# EasyEDA Pro project GEEKS_DEVELOPMENT_BOARD_STM32F4.eprj, board PCB1
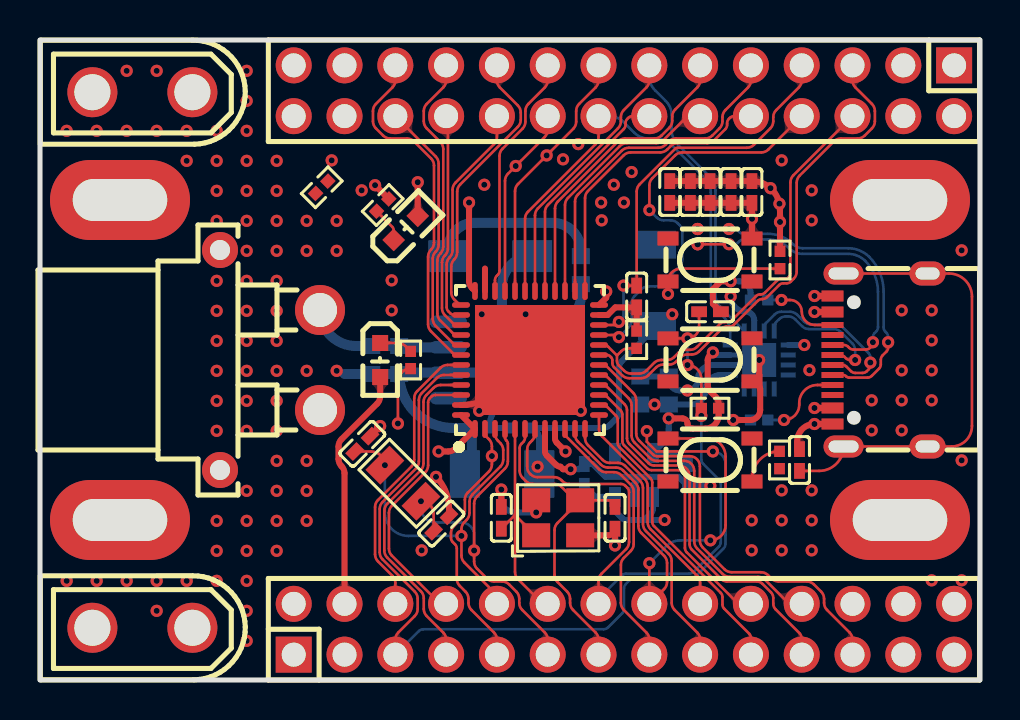
[diagram p2: board, top side]
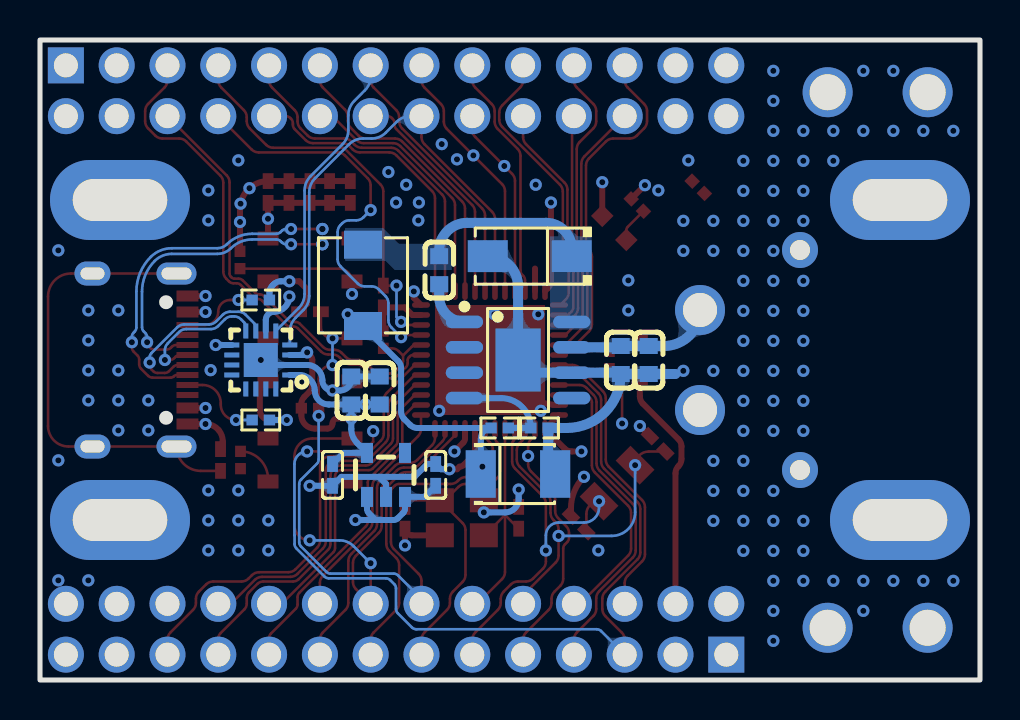
[diagram p3: board, bottom side, seen from below]

Outline 47 x 32 mm; copper layers: Top Layer, Inner1, Inner2, Bottom Layer. Coordinates in mm from the lower left corner of the outline.
Outline path: rectangle 0,32 47,0
Stack: Top Layer 0.035mm 外层铜厚1oz / Dielectric1 0.2104mm 7628 RC49% 8.6mil / Inner1 0.0152mm 内层铜厚 / Dielectric2 1.065mm 1.1mm H/HOZ 含铜 / Inner2 0.0152mm 内层铜厚 / Dielectric3 0.2104mm 7628 RC49% 8.6mil / Bottom Layer 0.035mm 外层铜厚1oz

## Design rules (mm)
net FS_D-: DP1
net FS_D+: DP1
template: 自定义配置
spacing copperThickness1oz (default): track to track 0.102, other pairs 0.152 to 0.3
spacing copperThickness2oz: track to track 0.203, other pairs 0.152 to 0.3
track width copperThickness1oz (default): min 0.13, default 0.13, max 0.5
track width copperThickness2oz: min 0.203, default 0.254, max 2.54
track width power: min 0.3, default 0.3, max 0.3
track width 12v: min 0.5, default 0.5, max 0.5
differential pair differentialPair (default): width min 0.127, default 0.254, max 2.54; gap min 0.152, default 0.152
via viaSize (default): diameter min 0.5, default 0.61, max 10; hole min 0.3, default 0.305, max 6.3
net 3V3 uses power
net GND uses power
net 5V uses power
net 12V uses 12v, copperRegion1
net AGND uses 12v, copperRegion1

## Placement (name value [footprint] x y rotation side)
C1  100nF  [C0402]  35.59 24.4 270 top
C2  100nF  [C0402]  34.55 24.4 270 top
C3  100nF  [C0402]  33.5 24.4 270 top
C4  100nF  [C0402]  32.52 24.4 270 top
C5  4.7uF  [C0402]  31.49 24.4 270 top
C34  100nF  [C0402]  33.5 18.41 180 top
C56  10uF  [C0402]  27.22 10.25 270 bottom
C57  10uF  [C0402]  32.37 10.25 90 bottom
C58  12pF  [C0402]  16.12 11.81 225 top
C59  12pF  [C0402]  20.07 7.82 225 top
C60  10pF  [C0402]  23.07 8.11 90 top
C61  10pF  [C0402]  28.75 8.11 90 top
C65  100nF  [C0402]  37.97 11 270 top
C67  100nF  [C0603]  31.44 14.48 270 bottom
C68  100nF  [C0603]  30.02 14.48 90 bottom
C70  10uF  [C0603]  17.96 16 90 bottom
C78  100nF  [C0603]  27.04 20.49 270 bottom
C79  220uF  [CASE-B_3528]  23.1 10.3 180 bottom
C80  10uF  [C0603]  16.57 16 90 bottom
C81  4.7uF  [C0402]  29.83 19.17 270 top
CN1  XT30UPB-M  [CONN-TH_XT30UPB-M]  5.12 29.39 180 top
CN2  XT30UPB-M  [CONN-TH_XT30UPB-M]  5.12 2.61 180 top
D1  SS34  [SMA_L4.3-W2.5-LS5.0-RD]  22.51 21.19 0 bottom
L5  15uH  [IND-SMD_L4.6-W4.2_SMMS0420]  30.85 19.73 90 bottom
LED3  19-217/BHC-BL2M2TY/3T  [LED0603-R-RD_BLUE]  18.29 22.6 45 top
LED4  19-217/BHC-BL2M2TY/3T  [LED0603-R-RD_BLUE]  17.01 16 270 top
NOREF  -  [Pad_e89]  43 8 0 top
NOREF#2  -  [Pad_e87]  4 8 0 top
NOREF#3  -  [Pad_e88]  43 24 0 top
NOREF#4  -  [Pad_e85]  4 24 0 top
R18  10kΩ  [R0402]  37 21 90 top
R20  10kΩ  [R0402]  33.5 13.59 0 top
R70  680Ω  [R0402]  17.13 23.75 45 top
R76  10kΩ  [R0402]  29.83 17.02 90 top
R77  5.1kΩ  [R0402]  35.96 13 180 bottom
R78  5.1kΩ  [R0402]  35.96 19 180 bottom
R79  100Ω  [R0402]  36.98 11 90 top
R82  10kΩ  [R0402]  24.01 12.6 0 bottom
R83  3.24kΩ  [R0402]  22.03 12.6 0 bottom
R84  680Ω  [R0402]  18.53 16 270 top
R85  0Ω  [R0402]  14.09 24.64 225 top
SW1  SKRPACE010  [KEY-SMD_4P-L4.2-W3.2-P2.20-LS4.6]  33.5 16.01 180 top
SW2  SKRPACE010  [KEY-SMD_4P-L4.2-W3.2-P2.20-LS4.6]  33.5 21 180 top
SW3  SKRPACE010  [KEY-SMD_4P-L4.2-W3.2-P2.20-LS4.6]  33.5 11 180 top
U1  STM32F401CCU6  [UFQFPN-48_L7.0-W7.0-P0.50-BL-EP]  24.5 16 0 top
U8  TPS5430DDA  [ESOP-8_L4.9-W3.9-P1.27-LS6.0-BL-EP-2]  23.09 16 270 bottom
U14  HT7833  [SOT-23-5_L2.9-W1.6-P0.95-LS2.8-BL]  29.7 10.25 180 bottom
U20  CH343P  [TQFN-16_L3.0-W3.0-P0.50-BL-EP1.7]  35.96 16 90 bottom
U31  XT30PW-F20.G.Y  [CONN-TH_XT30PW-F-1]  11.5 16 270 top
U32  GPHA201-1402A001A1BA  [HDR-TH_28P-P2.54-V-M-R2-C14-S2.54]  29.2 2.54 0 top
U33  GPHA201-1402A001A1BA  [HDR-TH_28P-P2.54-V-M-R2-C14-S2.54]  29.2 29.46 180 top
USB1  TYPE-C 16PIN 2MD(073)  [USB-C-SMD_TYPE-C-6PIN-2MD-073]  42 16 90 top
X1  8MHz  [OSC-SMD_4P-L3.2-W2.5-BL]  25.91 8.11 0 top
X2  32.768kHz  [OSC-SMD_L3.2-W1.5]  18.15 9.84 315 top

## Footprints (pads in the part's own frame, mm; a bottom-side part is the same pattern mirrored in y, then rotated)
C0402
  rect 0.79x0.54 smd: 1(-0.545,0) 2(0.545,0)
C0603
  rect 0.8x0.9 smd: 1(-0.7,0) 2(0.7,0)
CASE-B_3528
  rect 1.506x2.376 smd: 1(-1.861,0) 2(1.861,0)
CONN-TH_XT30PW-F-1
  round 2.5 hole 1.7: 1(-2.5,2.5) 2(2.5,2.5)
  round 1.8 hole 1: 3(5.5,-2.5) 4(-5.5,-2.5)
CONN-TH_XT30UPB-M
  round 2.5 hole 1.8: 1(-2.5,0) 2(2.5,0)
ESOP-8_L4.9-W3.9-P1.27-LS6.0-BL-EP-2
  oval 0.63x1.865 smd: 1(-1.905,-2.683) 2(-0.635,-2.683) 3(0.635,-2.683) 4(1.905,-2.683) 5(1.905,2.683) 6(0.635,2.683) 7(-0.635,2.683) 8(-1.905,2.683)
  rect 3.15x2.26 smd: 9(0,0)
HDR-TH_28P-P2.54-V-M-R2-C14-S2.54
  rect 1.8x1.8 hole 1.2: 1(-16.51,-1.27)
  round 1.8 hole 1.2: 2(-16.51,1.27) 3(-13.97,-1.27) 4(-13.97,1.27) 5(-11.43,-1.27) 6(-11.43,1.27) 7(-8.89,-1.27) 8(-8.89,1.27) 9(-6.35,-1.27) 10(-6.35,1.27) 11(-3.81,-1.27) 12(-3.81,1.27) 13(-1.27,-1.27) 14(-1.27,1.27) 15(1.27,-1.27) 16(1.27,1.27) 17(3.81,-1.27) 18(3.81,1.27) 19(6.35,-1.27) 20(6.35,1.27) 21(8.89,-1.27) 22(8.89,1.27) 23(11.43,-1.27) 24(11.43,1.27) 25(13.97,-1.27) 26(13.97,1.27) 27(16.51,-1.27) 28(16.51,1.27)
IND-SMD_L4.6-W4.2_SMMS0420
  rect 1.4x1.9 smd: 1(2.032,0) 2(-2.032,0)
KEY-SMD_4P-L4.2-W3.2-P2.20-LS4.6
  rect 1.05x0.7 smd: 1(-2.1,1.075) 2(2.1,1.075) 3(-2.1,-1.075) 4(2.1,-1.075)
LED0603-R-RD_BLUE
  rect 0.8x0.8 smd: 1(0.851,0) 2(-0.851,0)
OSC-SMD_4P-L3.2-W2.5-BL
  rect 1.4x1.2 smd: 1(-1.1,-0.875) 2(1.1,-0.875) 3(1.1,0.875) 4(-1.1,0.875)
OSC-SMD_L3.2-W1.5
  rect 1.05x1.7 smd: 1(-1.275,0) 2(1.275,0)
Pad_e85
  oval 7x4 hole 4.725x2.1: 1(0,0)
Pad_e87
  oval 7x4 hole 4.725x2.1: 1(0,0)
Pad_e88
  oval 7x4 hole 4.725x2.1: 1(0,0)
Pad_e89
  oval 7x4 hole 4.725x2.1: 1(0,0)
R0402
  rect 0.566x0.54 smd: 1(-0.433,0) 2(0.433,0)
SMA_L4.3-W2.5-LS5.0-RD
  rect 2x1.593 smd: 1(-2.1,0) 2(2.1,0)
SOT-23-5_L2.9-W1.6-P0.95-LS2.8-BL
  rect 0.6x1 smd: 1(-0.95,-1.1) 2(0,-1.1) 3(0.95,-1.1) 4(0.95,1.1) 5(-0.95,1.1)
TQFN-16_L3.0-W3.0-P0.50-BL-EP1.7
  rect 0.25x0.75 smd: 1(-0.749,-1.45) 2(-0.248,-1.45) 3(0.252,-1.45) 4(0.751,-1.45) 9(0.75,1.45) 10(0.25,1.45) 11(-0.25,1.45) 12(-0.749,1.45)
  rect 0.75x0.25 smd: 5(1.45,-0.75) 6(1.45,-0.25) 7(1.45,0.25) 8(1.45,0.75) 13(-1.45,0.75) 14(-1.45,0.25) 15(-1.45,-0.25) 16(-1.45,-0.75)
  rect 1.7x1.7 smd: 17(0.001,0)
UFQFPN-48_L7.0-W7.0-P0.50-BL-EP
  oval 0.28x0.9 smd: 1(-2.751,-3.45) 2(-2.251,-3.45) 3(-1.75,-3.45) 4(-1.25,-3.45) 5(-0.749,-3.45) 6(-0.249,-3.45) 7(0.249,-3.45) 8(0.75,-3.45) 9(1.25,-3.45) 10(1.75,-3.45) 11(2.251,-3.45) 12(2.751,-3.45) 25(2.751,3.449) 26(2.251,3.449) 27(1.75,3.449) 28(1.25,3.449) 29(0.75,3.449) 30(0.249,3.449) 31(-0.249,3.449) 32(-0.749,3.449) 33(-1.25,3.449) 34(-1.75,3.449) 35(-2.251,3.449) 36(-2.751,3.449)
  oval 0.9x0.28 smd: 13(3.45,-2.751) 14(3.45,-2.251) 15(3.45,-1.75) 16(3.45,-1.25) 17(3.45,-0.75) 18(3.45,-0.249) 19(3.45,0.249) 20(3.45,0.749) 21(3.45,1.25) 22(3.45,1.75) 23(3.45,2.251) 24(3.45,2.751) 37(-3.449,2.751) 38(-3.449,2.251) 39(-3.449,1.75) 40(-3.449,1.25) 41(-3.449,0.749) 42(-3.449,0.249) 43(-3.449,-0.249) 44(-3.449,-0.75) 45(-3.449,-1.25) 46(-3.449,-1.75) 47(-3.449,-2.251) 48(-3.449,-2.751)
  rect 5.5x5.5 smd: 49(0,0)
USB-C-SMD_TYPE-C-6PIN-2MD-073
  rect 0.55x1.1 smd: 1(-3.2,2.375) 2(-2.4,2.375) 11(2.4,2.375) 12(3.2,2.375)
  rect 0.3x1.1 smd: 3(-1.75,2.375) 4(-1.25,2.375) 5(-0.75,2.375) 6(-0.25,2.375) 7(0.25,2.375) 8(0.75,2.375) 9(1.25,2.375) 10(1.75,2.375)
  oval 1.1x2 hole 0.6x1.5: 13(-4.325,1.825) 14(4.325,1.825)
  oval 1.2x1.8 hole 0.6x1.2: 13(-4.325,-2.375) 14(4.325,-2.375)

## Nets
As in the schematic.

Pads without a net: NOREF 1; NOREF#2 1; NOREF#3 1; NOREF#4 1; SW1 2 3; SW2 1 4; SW3 2 3; U8 2 3 5; U14 4; U20 10 11 14 15 16; USB1 3 9

## Via types
v1: diameter 0.61, hole 0.305, Top Layer to Bottom Layer, 79 vias
v2: diameter 0.61, hole 0.304, Top Layer to Bottom Layer, 100 vias

## Routing (per net, layer and track width the routed paths; a pad name or vN(x,y) marks a point on that pad's centre or on a via; arc(x,y) is an arc through that point)
3V3: length 68.2
  Top Layer w0.3: v1(19.93,11.43) 20.42,11.43 arc(20.61,11.47) 20.77,11.57 U1.1 U1.48 ; U1.36 21.6,19.6 arc(21.49,19.76) 21.45,19.95 v1(21.45,23.87) ; U1.9 25.75,12.08 arc(25.77,11.97) 25.84,11.87 v1(26.28,11.43) ; v1(33.64,16.38) 33.47,16.21 arc(33.41,16.11) 33.38,16 33.38,14.76 arc(33.42,14.57) 33.53,14.41 33.79,14.15 arc(33.89,13.99) 33.93,13.8 R20.2 33.93,13.24 arc(33.74,12.77) 33.26,12.57 32.63,12.57 arc(32.45,12.65) 32.37,12.83 arc(32.3,13) 32.12,13.08 v1(31.44,13.08) ; v1(28.31,19.43) 28.31,19.11 U1.24 ; U32.4 15.23,10.33 arc(15.19,10.53) 15.08,10.69 15.07,10.7 arc(14.96,10.86) 14.93,11.05 14.93,11.68 arc(14.96,11.87) 15.07,12.03 16.86,13.82 arc(16.97,13.98) 17.01,14.17 LED4.1 ; C5.2 C4.2 C3.2 C2.2 C1.2 arc(35.6,23.85) 35.6,23.85 v1(35.6,23.06) SW2.3 ; LED3.1 v1(18.89,24.89)
  Inner1 w0.3: U32.4 U32.2 U32.1 ; U32.4 15.23,7.45 arc(15.3,7.83) 15.52,8.16 18.5,11.14 arc(18.82,11.35) 19.21,11.43 v1(19.93,11.43) ; U32.4 U32.3
  Bottom Layer w0.3: v1(33.64,16.38) 33.77,16.25 U20.3 ; C57.2 31.82,11.36 30.65,11.36 31.14,11.85 arc(31.36,12.17) 31.44,12.56 v1(31.44,13.08) C67.2 ; U20.6 35.71,18 arc(35.59,18.29) 35.29,18.41 arc(34.76,18.64) v1(34.53,19.17) ; C67.2 v1(30.73,13.78) C68.1 ; C67.2 32.56,13.78 arc(33.06,13.98) 33.26,14.48 arc(33.49,15.02) 34.04,15.25 U20.1 ; U20.9 v1(38.22,16.75)
5V: length 71.8
  Top Layer w0.3: USB1.11 v1(38.72,18.4) ; USB1.2 v1(38.72,13.6)
  Inner1 w0.3: U33.27 U33.28 U33.26 ; U33.26 15.23,27.59 arc(15.3,27.21) 15.52,26.89 21.67,20.74 arc(21.99,20.52) 22.37,20.44 31.49,20.44 arc(32.02,20.22) 32.25,19.68 32.25,18.92 arc(32.06,18.47) v1(31.61,18.29) 31.81,18.09 arc(31.97,17.98) 32.16,17.94 38.06,17.94 arc(38.25,17.98) 38.42,18.09 v1(38.72,18.4) 38.86,18.4 39.32,17.94 arc(39.54,17.62) 39.61,17.24 39.61,14.9 arc(39.54,14.52) 39.32,14.2 v1(38.72,13.6) ; U33.26 U33.25 ; v1(31.23,8) 27.55,8 v1(24.88,10.67)
  Bottom Layer w0.3: U14.1 30.65,8.56 arc(30.63,8.44) 30.56,8.35 30.22,8 ; C56.2 27.77,9.16 U14.3 28.75,8.57 arc(28.77,8.46) 28.84,8.36 29.11,8.09 arc(29.21,8.02) 29.32,8 30.22,8 ; 30.22,8 v1(31.23,8) ; 24.96,10.28 24.96,12.09 arc(24.81,12.45) R82.2 28.13,12.6 arc(28.32,12.64) 28.49,12.75 28.8,13.06 arc(28.91,13.22) 28.94,13.41 28.94,15.59 arc(28.98,15.78) 29.09,15.94 30.85,17.7
12V: length 7.5
  Bottom Layer w0.5: U8.7 18.12,16.64 arc(18.03,16.65) C70.2 C80.2 15.8,16.7 arc(14.53,17.23) U31.1
AGND: length 22
  Bottom Layer w0.5: C70.1 C80.1 15.23,15.3 ; C70.1 arc(18.75,13.39) 20.66,12.6 R83.1 21.59,10.64 arc(21.49,10.39) 21.23,10.28 ; C70.1 arc(17.98,15.35) 18.03,15.36 U8.6 22.46,15.36 arc(22.91,15.55) U8.9 23.09,19.67 arc(23.54,20.75) D1.2
  vias: v2(1.33,27.46) v2(1.33,4.96) v2(2.83,27.46) v2(2.83,4.96) v2(4.33,30.46) v2(4.33,27.46) v2(4.33,4.96) v2(5.83,30.46) v2(5.83,27.46) v2(5.83,4.96) v2(5.83,3.46) v2(7.33,27.46) v2(7.33,25.96) v2(7.33,4.96) v2(8.83,27.46) v2(8.83,25.96) v2(8.83,24.46) v2(8.83,22.96) v2(8.83,19.96) v2(8.83,18.46) v2(8.83,16.96) v2(8.83,15.46) v2(8.83,13.96) v2(8.83,12.46) v2(8.83,7.96) v2(8.83,6.46) v2(8.83,4.96) v2(10.33,30.46) v2(10.33,28.96) v2(10.33,27.46) v2(10.33,25.96) v2(10.33,24.46) v2(10.33,22.96) v2(10.33,21.46) v2(10.33,19.96) v2(10.33,18.46) v2(10.33,16.96) v2(10.33,15.46) v2(10.33,13.96) v2(10.33,12.46) v2(10.33,9.46) v2(10.33,7.96) v2(10.33,6.46) v2(10.33,4.96) v2(10.33,3.46) v2(10.33,1.96) v2(11.83,25.96) v2(11.83,24.46) v2(11.83,22.96) v2(11.83,21.46) v2(11.83,19.96) v2(11.83,18.46) v2(11.83,16.96) v2(11.83,15.46) v2(11.83,13.96) v2(11.83,12.46) v2(11.83,10.96) v2(11.83,9.46) v2(11.83,7.96) v2(11.83,6.46) v2(13.33,22.96) v2(13.33,21.46) v2(13.33,15.46) v2(13.33,10.96) v2(13.33,9.46) v2(13.33,7.96) v2(14.83,22.96) v2(14.83,21.46) v2(14.83,15.46)
GND: length 59.8
  Top Layer w0.3: v1(28.75,6.73) C61.1 arc(28.65,7.33) 28.42,7.23 X1.2 ; C34.1 33.64,18.81 33.64,19.54 34.04,19.94 v1(34.53,19.94) ; v1(34.66,13) 35.51,13 arc(35.86,13.15) 36.01,13.5 36.01,14.52 arc(35.89,14.81) SW1.1 arc(35.85,15.04) 35.96,15.29 v1(35.96,16) ; R18.2 v1(37,22.9) 37,23.54 arc(36.88,24.12) v1(36.53,24.59) arc(36.09,24.85) C1.1 C2.1 C3.1 C4.1 C5.1 ; v1(26.53,10.54) 26.15,10.54 26.02,10.67 arc(25.91,10.69) 25.81,10.75 25.34,11.23 arc(25.27,11.32) 25.25,11.44 U1.8 ; C58.1 v1(17.01,12.7) ; USB1.12 v1(38.72,19.2) ; U1.23 28.38,18.25 28.76,18.63 C81.2 29.83,17.45 ; 17.44,24.05 v1(16.75,24.74) ; 22.25,20.57 U1.35 ; C60.2 v1(23.07,9.52) ; USB1.1 v1(38.72,12.8) arc(38.36,12.72) 38.06,12.49 arc(37.91,12.23) 37.86,11.94 37.86,11.43 arc(37.94,11.47) C65.1 ; U1.49 23.1,14.6 arc(22.61,14.2) 22.04,13.92 arc(21.55,13.79) U1.47 ; C59.1 20.45,8.59 arc(20.28,9.44) v1(19.8,10.16) ; X1.4 v1(24.81,8.38)
  Bottom Layer w0.3: v1(33.52,9.71) C57.1 31.93,10.16 30.05,10.16 ; v1(24.81,8.38) 23.74,8.38 arc(23.26,8.58) 23.07,9.05 v1(23.07,9.52) ; C68.2 C67.1 31.44,15.03 arc(31.6,14.64) 31.99,14.48 v1(32.37,14.48) arc(32.73,14.62) 32.88,14.98 arc(33.11,15.53) 33.65,15.75 U20.2 35.71,15.75 arc(35.89,15.82) v1(35.96,16) ; R77.2 v1(34.66,13) ; v1(26.53,10.54) 26.95,10.54 C56.1 27.63,10.8 28.28,10.16 30.05,10.16 ; 30.05,10.16 29.7,9.81 U14.2 ; R78.2 35.53,19.37 arc(35.49,19.56) 35.38,19.72 35.31,19.79 arc(35.15,19.9) 34.96,19.94 v1(34.53,19.94)
  vias: v1(21.96,13.46) v1(22.09,18.29) v1(22.21,24.76) v1(24.28,18.29) v1(26.15,26.03) v1(26.91,26.8) v1(27.04,13.46) v1(28.06,23.87) v1(28.69,24.76) v1(29.2,23.87) v1(29.58,25.4) v1(36.97,23.82) v1(38.47,15.49) v2(14.58,25.98) v2(16.08,24.48) v2(17.58,19.98) v2(17.58,18.48) v2(19.08,6.48) v2(28.08,22.98) v2(35.58,7.98) v2(35.58,6.48) v2(37.08,25.98) v2(37.08,9.48) v2(37.08,7.98) v2(37.08,6.48) v2(38.58,24.48) v2(38.58,22.98) v2(38.58,9.48) v2(38.58,7.98) v2(38.58,6.48) v2(41.58,13.98) v2(41.58,12.48) v2(43.08,18.48) v2(43.08,15.48) v2(43.08,13.98) v2(43.08,12.48) v2(44.58,18.48) v2(44.58,16.98) v2(44.58,15.48) v2(44.58,13.98) v2(44.58,4.98) v2(46.08,21.48) v2(46.08,10.98) v2(46.08,4.98)
BOOT0: length 60.2
  Top Layer w0.13: v1(31.4,19.3) SW2.2 arc(31.59,20.38) 32.04,20.57 R18.1 ; U1.44 20.2,15.25 arc(20.01,15.21) 19.85,15.1 19.09,14.35 arc(18.98,14.18) 18.94,13.99 18.94,10.92 arc(18.91,10.73) 18.8,10.57 17.13,8.9 arc(17.02,8.74) 16.98,8.55 16.98,6.38 arc(17.02,6.19) 17.13,6.03 18.74,4.42 arc(18.85,4.26) 18.88,4.07 18.88,3.55 arc(18.85,3.36) 18.74,3.2 17.91,2.37 arc(17.8,2.21) 17.77,2.02 U32.5 ; 30.82,11.43 30.34,11.91 v1(30.34,12.44) ; v1(33.64,11.43) arc(32.95,11.43) 32.25,11.43 arc(31.54,11.43) 30.82,11.43
  Inner1 w0.13: v1(31.4,19.3) 31.4,18.81 29.83,17.25 29.83,12.95 v1(30.34,12.44)
  Bottom Layer w0.13: U32.5 18.95,2.45 arc(19.05,2.52) 19.16,2.54 28.19,2.54 arc(28.3,2.56) 28.4,2.63 29.11,3.34 arc(29.18,3.44) 29.2,3.55 29.2,4.58 arc(29.22,4.7) 29.29,4.79 29.49,5 arc(29.59,5.06) 29.7,5.09 32.56,5.09 arc(32.68,5.11) 32.77,5.17 34.18,6.58 arc(34.25,6.68) 34.27,6.8 34.27,7.23 34.28,7.24 34.28,10.79 arc(34.09,11.24) v1(33.64,11.43)
FS_D+: length 41.1
  Top Layer w0.13: v1(41.65,16.89) 41.65,16.75 41.51,16.61 arc(41.41,16.55) 41.29,16.52 40.67,16.52 arc(40.56,16.55) 40.46,16.61 40.41,16.66 arc(40.31,16.73) 40.19,16.75 USB1.8 ; U33.18 25.39,27.51 arc(25.35,27.32) 25.24,27.15 v1(23.79,25.7) 23.4,25.31 arc(23.29,25.15) 23.25,24.96 U1.33 ; v1(34.45,21.79) v1(32.88,21.79)
  Inner1 w0.13: v1(23.79,25.7) 23.97,25.7 24.64,25.03 arc(24.7,24.93) 24.73,24.82 24.73,24.6 arc(24.75,24.49) 24.81,24.39 27.09,22.12 arc(27.19,22.05) 27.3,22.03 27.53,22.03 arc(27.62,21.99) 27.65,21.9 27.65,21.46 arc(27.78,21.33) 27.91,21.46 27.91,21.9 arc(27.94,21.99) 28.03,22.03 28.31,22.03 arc(28.4,21.99) 28.43,21.9 28.43,21.47 arc(28.56,21.35) 28.69,21.47 28.69,21.9 arc(28.73,21.99) 28.81,22.03 29.11,22.03 arc(29.2,21.99) 29.23,21.9 29.23,21.46 arc(29.36,21.33) 29.49,21.46 29.49,21.9 arc(29.52,21.99) 29.61,22.03 29.88,22.03 arc(29.97,21.99) 30.01,21.9 30.01,21.46 arc(30.13,21.33) 30.26,21.46 30.26,21.9 arc(30.3,21.99) 30.39,22.03 30.68,22.03 arc(30.77,21.99) 30.8,21.9 30.8,21.76 arc(30.93,21.63) 31.06,21.76 31.06,21.9 arc(31.09,21.99) 31.18,22.03 32.15,22.03 arc(32.26,22.01) 32.36,21.94 32.42,21.88 arc(32.52,21.81) 32.64,21.79 v1(32.88,21.79)
  Bottom Layer w0.13: v1(41.65,16.89) 41.65,17.13 arc(41.67,17.25) 41.73,17.35 41.81,17.42 arc(41.88,17.52) 41.9,17.64 41.9,19.42 arc(41.73,20.25) 41.26,20.95 arc(40.87,21.21) 40.41,21.31 38.13,21.31 arc(37.77,21.38) 37.45,21.59 arc(36.97,21.91) 36.39,22.03 35.18,22.03 arc(35.07,22.01) 34.97,21.94 34.91,21.88 arc(34.81,21.81) 34.69,21.79 v1(34.45,21.79)
FS_D-: length 41
  Top Layer w0.13: v1(34.45,22.55) v1(32.88,22.55) ; USB1.5 40.16,15.25 arc(40.23,15.23) 40.3,15.19 40.31,15.18 arc(40.38,15.14) 40.45,15.12 41.38,15.12 arc(41.49,15.14) 41.59,15.21 41.95,15.57 arc(42.02,15.67) 42.04,15.78 42.04,16.02 arc(42.06,16.13) 42.13,16.23 42.32,16.42 arc(42.38,16.52) 42.41,16.63 v1(42.41,16.89) ; U1.32 23.75,24.44 arc(23.79,24.63) 23.9,24.8 v1(25.33,26.23) 26.66,27.56 arc(26.77,27.72) 26.81,27.91 26.81,28.45 arc(26.85,28.64) 26.96,28.8 27.78,29.63 arc(27.89,29.79) 27.93,29.98 U33.15
  Inner1 w0.13: v1(25.33,26.23) 25.33,25.47 arc(25.31,25.35) 25.24,25.25 25.1,25.11 arc(25.03,25.01) 25.01,24.89 25.01,24.72 arc(25.03,24.61) 25.1,24.51 27.21,22.4 arc(27.3,22.33) 27.42,22.31 32.15,22.31 arc(32.26,22.33) 32.36,22.4 32.42,22.46 arc(32.52,22.53) 32.64,22.55 v1(32.88,22.55)
  Bottom Layer w0.13: v1(42.41,16.89) 42.41,17.15 arc(42.38,17.27) 42.32,17.37 42.27,17.42 arc(42.2,17.51) 42.18,17.63 42.18,19.42 arc(41.99,20.36) 41.46,21.15 arc(40.98,21.47) 40.41,21.59 38.13,21.59 arc(37.87,21.64) 37.65,21.79 arc(37.07,22.17) 36.39,22.31 35.18,22.31 arc(35.07,22.33) 34.97,22.4 34.91,22.46 arc(34.81,22.53) 34.69,22.55 v1(34.45,22.55)
NRST: length 34.9
  Top Layer w0.13: SW1.4 v1(32.37,17.08) arc(32.78,17.25) 32.96,17.66 C34.2 ; v1(33.07,13.21) R20.1 33.07,15.05 arc(32.86,15.54) v1(32.37,15.75) ; v1(27.93,3.94) 27.93,4.96 arc(27.96,5.15) 28.07,5.31 29.31,6.55 arc(29.41,6.71) 29.45,6.9 29.45,9.4 arc(29.43,9.51) 29.37,9.61 29.26,9.72 ; U1.7 24.75,12.33 arc(24.71,12.14) 24.6,11.97 24.5,11.88 arc(24.4,11.71) 24.36,11.52 24.36,10.66 arc(24.4,10.47) 24.5,10.3 24.52,10.29 arc(24.68,10.18) 24.87,10.14 25.71,10.14 arc(25.9,10.11) 26.06,10 26.11,9.95 arc(26.27,9.84) 26.47,9.8 29.05,9.8 arc(29.16,9.78) 29.26,9.72
  Bottom Layer w0.13: v1(32.37,15.75) v1(32.37,17.08) ; U32.14 v1(27.93,3.94) arc(27.95,4.05) 28.01,4.15 29.1,5.23 arc(29.19,5.29) 29.31,5.32 32.47,5.32 arc(32.58,5.34) 32.68,5.41 33.95,6.68 arc(34.02,6.78) 34.04,6.89 34.04,9.8 arc(34.02,9.92) 33.95,10.01 33.16,10.81 arc(33.09,10.91) 33.07,11.02 v1(33.07,13.21)
OSC32_I: length 19.1
  Top Layer w0.13: U1.3 22.75,12.32 arc(22.79,12.13) 22.9,11.96 23.02,11.84 arc(23.12,11.68) 23.16,11.49 23.16,11.02 arc(23.12,10.83) 23.02,10.67 21.62,9.27 arc(21.51,9.11) 21.47,8.92 21.47,8.36 arc(21.44,8.16) 21.33,8 21.22,7.89 arc(21.11,7.73) 21.07,7.54 v1(21.07,7.2) 21.07,6.23 arc(21.11,6.04) 21.22,5.87 22.7,4.39 arc(22.81,4.23) 22.85,4.04 U32.10 ; C58.2 16.56,11.42 arc(17.05,11.22) v1(17.25,10.74)
  Bottom Layer w0.13: v1(21.07,7.2) 18.42,7.2 arc(17.59,7.55) 17.25,8.38 v1(17.25,10.74)
OSC32_O: length 20.2
  Top Layer w0.13: U1.4 23.25,12.12 arc(23.27,12.05) 23.31,11.98 23.34,11.96 arc(23.38,11.89) 23.39,11.82 23.39,10.93 arc(23.36,10.73) 23.25,10.57 21.85,9.18 arc(21.74,9.02) 21.71,8.82 v1(21.71,6.47) 21.71,5.92 arc(21.74,5.73) 21.85,5.57 22.35,5.07 arc(22.51,4.96) 22.7,4.93 23.1,4.93 arc(23.29,4.89) 23.46,4.78 23.82,4.42 arc(23.93,4.26) 23.96,4.06 23.96,3.86 arc(24,3.67) 24.11,3.5 25.24,2.37 arc(25.35,2.21) 25.39,2.02 U32.11 ; 19.68,7.44 19.68,8.31 arc(19.5,8.75) v1(19.05,8.94)
  Bottom Layer w0.13: v1(19.05,8.94) 19.05,8.62 arc(19.27,8.09) 19.8,7.87 21.07,7.87 arc(21.52,7.69) 21.71,7.24 v1(21.71,6.47)
OSC_I: length 12
  Top Layer w0.13: 23.75,8.25 24.76,7.23 X1.1 ; 23.75,8.25 23.75,5.4 arc(23.79,5.21) 23.9,5.05 25.13,3.81 U32.12 ; 23.75,8.25 C60.1 ; 23.75,8.25 U1.5
OSC_O: length 16.8
  Top Layer w0.13: X1.3 28.42,8.98 arc(28.65,8.89) C61.2 ; X1.3 25.87,7.85 arc(25.76,7.69) 25.73,7.5 25.73,5.26 arc(25.76,5.06) 25.87,4.9 26.36,4.42 arc(26.47,4.26) 26.5,4.06 26.5,3.86 arc(26.54,3.67) 26.65,3.5 27.78,2.37 arc(27.89,2.21) 27.93,2.02 U32.13 ; X1.3 26.87,8.98 arc(26.76,9.01) 26.66,9.07 26.08,9.66 arc(25.92,9.76) 25.72,9.8 24.64,9.8 arc(24.45,9.84) 24.29,9.95 24.13,10.11 arc(24.02,10.27) 23.98,10.46 23.98,11.6 arc(24.01,11.71) 24.07,11.81 24.16,11.9 arc(24.23,12) 24.25,12.11 U1.6
PA0: length 13.9
  Top Layer w0.13: U32.15 30.47,2.02 arc(30.43,2.21) 30.32,2.37 29.19,3.5 arc(29.08,3.67) 29.04,3.86 29.04,5.75 arc(29.08,5.94) 29.19,6.1 29.54,6.45 arc(29.65,6.61) 29.69,6.81 29.69,9.41 arc(29.65,9.6) 29.54,9.77 29.06,10.24 arc(28.9,10.35) 28.71,10.39 28.3,10.39 arc(28.11,10.43) 27.95,10.54 26.25,12.24 U1.10
PA1: length 24.9
  Top Layer w0.13: SW3.4 33.38,12.08 arc(34.02,11.81) 34.28,11.17 34.28,7.75 arc(34.06,7.21) v1(33.52,6.98) ; U1.11 26.75,12.27 arc(26.79,12.08) 26.9,11.92 28.04,10.77 arc(28.21,10.66) 28.4,10.62 28.8,10.62 arc(28.99,10.58) 29.16,10.48 29.77,9.86 arc(29.88,9.7) 29.92,9.51 29.92,7.7 arc(29.96,7.51) 30.06,7.35 31.21,6.21 arc(31.31,6.05) 31.35,5.86 31.35,4.9 arc(31.31,4.71) 31.21,4.55 U32.16 30.47,5.84 v1(30.47,5.84)
  Bottom Layer w0.13: v1(30.47,5.84) 31.32,6.69 arc(31.64,6.91) 32.03,6.98 v1(33.52,6.98)
PA2: length 14
  Top Layer w0.13: U32.17 33.01,2.02 arc(32.97,2.21) 32.86,2.37 31.73,3.5 arc(31.62,3.67) 31.58,3.86 31.58,5.95 arc(31.55,6.14) 31.44,6.3 30.3,7.45 arc(30.19,7.61) 30.15,7.8 30.15,9.6 arc(30.11,9.8) 30,9.96 29.25,10.71 arc(29.09,10.82) 28.9,10.85 28.49,10.85 arc(28.3,10.89) 28.14,11 27.4,11.74 arc(27.29,11.9) 27.25,12.1 U1.12
PA3: length 11.4
  Top Layer w0.13: U32.18 33.01,4.86 arc(32.97,5.05) 32.86,5.21 30.53,7.54 arc(30.42,7.7) 30.38,7.89 30.38,9.7 arc(30.34,9.89) 30.23,10.05 28.1,12.19 arc(27.99,12.35) 27.95,12.55 U1.13
PA4: length 15.7
  Top Layer w0.13: U1.14 28.14,13.75 arc(28.25,13.73) 28.35,13.66 28.8,13.22 arc(28.86,13.12) 28.89,13 28.89,11.85 arc(28.91,11.74) 28.97,11.64 30.53,10.09 arc(30.59,9.99) 30.61,9.88 30.61,7.91 arc(30.64,7.79) 30.7,7.69 34.04,4.36 arc(34.1,4.26) 34.12,4.15 34.12,3.77 arc(34.15,3.66) 34.21,3.56 35.46,2.32 arc(35.52,2.22) 35.55,2.1 U32.19
PA5: length 15
  Top Layer w0.13: U1.15 28.14,14.25 arc(28.26,14.23) 28.35,14.16 29.03,13.48 arc(29.09,13.39) 29.12,13.27 29.12,11.95 arc(29.14,11.83) 29.21,11.74 30.36,10.58 arc(30.46,10.52) 30.57,10.49 31.95,10.49 arc(32.16,10.4) 32.25,10.19 32.25,6.6 arc(32.27,6.48) 32.34,6.39 34.83,3.9 arc(34.92,3.83) 35.04,3.81 U32.20
PA6: length 19.7
  Top Layer w0.13: U1.16 28.26,14.75 29.23,13.78 arc(29.32,13.65) 29.35,13.5 29.35,12.09 arc(29.38,11.93) 29.47,11.8 30.43,10.84 arc(30.56,10.75) 30.71,10.72 31.95,10.72 arc(32.32,10.57) 32.48,10.19 32.48,6.79 arc(32.51,6.64) 32.6,6.51 34.06,5.04 arc(34.19,4.96) 34.35,4.93 35.84,4.93 arc(36,4.89) 36.13,4.81 36.55,4.39 arc(36.63,4.26) 36.66,4.11 36.66,3.82 arc(36.69,3.66) 36.78,3.53 37.97,2.34 arc(38.06,2.22) 38.09,2.06 U32.21
PA7: length 18.1
  Top Layer w0.13: U32.22 37.66,3.81 arc(37.47,3.85) 37.31,3.95 36.25,5.01 arc(36.09,5.12) 35.9,5.16 34.48,5.16 arc(34.29,5.2) 34.13,5.3 32.86,6.58 arc(32.75,6.74) 32.71,6.93 32.71,10.46 arc(32.56,10.81) 32.21,10.96 30.85,10.96 arc(30.66,10.99) 30.5,11.1 29.73,11.87 arc(29.62,12.03) 29.58,12.22 29.58,13.73 arc(29.54,13.92) 29.43,14.08 28.26,15.25 U1.17
PA8: length 11.4
  Top Layer w0.13: U1.29 25.25,23.4 arc(25.29,23.59) 25.4,23.75 29.19,27.55 arc(29.25,27.64) 29.28,27.76 29.28,27.84 arc(29.3,27.96) 29.36,28.05 29.41,28.1 arc(29.51,28.17) 29.63,28.19 U33.14
PA15: length 11.4
  Top Layer w0.13: U33.20 22.85,27.15 arc(22.81,26.95) 22.7,26.79 20.77,24.87 arc(20.67,24.7) 20.63,24.51 20.63,21.48 arc(20.59,21.29) 20.48,21.13 20.48,21.13 arc(20.37,20.97) 20.33,20.77 20.33,18.64 arc(20.35,18.53) 20.42,18.43 20.51,18.34 arc(20.61,18.27) 20.72,18.25 U1.38
PB0: length 23
  Top Layer w0.13: U1.18 28.26,15.75 29.66,14.35 arc(29.77,14.19) 29.81,14 29.81,12.32 arc(29.85,12.13) 29.96,11.97 30.66,11.27 arc(30.75,11.21) 30.85,11.19 30.98,11.19 arc(31.74,11.19) 32.49,11.19 ; U32.23 40.63,2.02 arc(40.59,2.21) 40.48,2.37 39.35,3.5 arc(39.24,3.67) 39.2,3.86 39.2,4.06 arc(39.17,4.26) 39.06,4.42 38.7,4.78 arc(38.53,4.89) 38.34,4.93 36.92,4.93 arc(36.73,4.96) 36.57,5.07 36.4,5.24 arc(36.24,5.35) 36.05,5.39 34.58,5.39 arc(34.39,5.43) 34.23,5.53 33.14,6.62 arc(33.03,6.78) 32.99,6.97 32.99,10.69 arc(32.85,11.04) 32.49,11.19
PB1: length 25.6
  Top Layer w0.13: U1.19 28.36,16.25 arc(28.44,16.23) 28.5,16.19 28.56,16.13 arc(28.6,16.07) 28.62,15.99 28.62,15.85 arc(28.64,15.73) 28.7,15.64 29.11,15.24 arc(29.27,15.13) 29.46,15.09 30.06,15.09 arc(30.25,15.13) 30.41,15.24 30.8,15.62 arc(30.96,15.73) 31.15,15.77 31.45,15.77 arc(31.64,15.81) 31.8,15.92 32.02,16.13 arc(32.18,16.24) 32.37,16.28 32.59,16.28 arc(32.78,16.31) 32.95,16.42 34.11,17.58 arc(34.2,17.65) 34.32,17.67 34.48,17.67 arc(34.59,17.69) 34.69,17.76 35.89,18.96 arc(35.99,19.03) 36.1,19.05 36.13,19.05 arc(36.25,19.07) 36.34,19.14 36.96,19.75 arc(37.05,19.81) 37.17,19.84 37.33,19.84 arc(37.45,19.86) 37.54,19.92 37.69,20.07 arc(37.8,20.23) 37.84,20.42 37.84,24.87 arc(37.87,25.06) 37.98,25.22 39.69,26.93 arc(39.85,27.04) 40.04,27.07 40.88,27.07 arc(41.07,27.11) 41.24,27.22 41.6,27.58 arc(41.71,27.74) 41.74,27.94 41.74,28.45 arc(41.71,28.64) 41.6,28.8 40.77,29.63 arc(40.66,29.79) 40.63,29.98 U33.5
PB2: length 22.5
  Top Layer w0.13: 28.85,16.22 28.85,15.95 arc(28.87,15.83) 28.94,15.73 29.2,15.47 arc(29.37,15.36) 29.56,15.32 29.96,15.32 arc(30.16,15.36) 30.32,15.47 30.7,15.85 arc(30.87,15.96) 31.06,16 31.35,16 arc(31.55,16.04) 31.71,16.15 31.92,16.36 arc(32.08,16.47) 32.28,16.51 32.5,16.51 arc(32.69,16.55) 32.85,16.65 34.01,17.81 arc(34.11,17.88) 34.22,17.9 34.38,17.9 arc(34.5,17.93) 34.59,17.99 35.8,19.19 arc(35.89,19.26) 36.01,19.28 36.04,19.28 arc(36.15,19.3) 36.25,19.37 36.86,19.98 arc(36.96,20.04) 37.07,20.07 37.28,20.07 arc(37.35,20.08) 37.42,20.13 37.46,20.17 arc(37.51,20.24) 37.52,20.31 37.52,24.88 arc(37.56,25.07) 37.67,25.23 U33.6 ; 28.85,16.22 28.41,16.66 arc(28.31,16.73) 28.2,16.75 U1.20 ; 28.85,16.22 29.06,16.44 arc(29.22,16.54) 29.41,16.58 R76.1
PB3: length 11.1
  Top Layer w0.13: U1.39 20.86,17.75 arc(20.75,17.77) 20.65,17.84 20.25,18.24 arc(20.14,18.4) 20.1,18.59 20.1,20.87 arc(20.14,21.06) 20.25,21.22 20.25,21.23 arc(20.36,21.39) 20.4,21.58 20.4,28.1 U33.22
PB4: length 15
  Top Layer w0.13: U1.40 20.86,17.25 arc(20.75,17.27) 20.65,17.34 20.01,17.97 arc(19.91,18.13) 19.87,18.33 19.87,20.97 arc(19.91,21.16) 20.01,21.32 20.02,21.32 arc(20.13,21.49) 20.16,21.68 20.16,26.55 arc(20.13,26.74) 20.02,26.9 19.34,27.58 arc(19.23,27.74) 19.19,27.94 19.19,28.45 arc(19.23,28.64) 19.34,28.8 20.16,29.63 arc(20.27,29.79) 20.31,29.98 U33.21
PB5: length 13.1
  Top Layer w0.13: U33.24 19.79,26.17 arc(19.89,26.01) 19.93,25.82 19.93,21.77 arc(19.89,21.58) 19.79,21.42 19.78,21.42 arc(19.67,21.25) 19.64,21.06 19.64,18.06 arc(19.67,17.86) 19.78,17.7 20.65,16.84 arc(20.75,16.77) 20.86,16.75 U1.41
PB6: length 17.7
  Top Layer w0.13: U1.42 20.86,16.25 arc(20.75,16.27) 20.65,16.34 19.55,17.43 arc(19.44,17.6) 19.4,17.79 19.4,21.16 arc(19.44,21.35) 19.55,21.51 19.55,21.52 arc(19.66,21.68) 19.7,21.87 19.7,25.72 arc(19.66,25.91) 19.55,26.08 18.7,26.93 arc(18.54,27.04) 18.35,27.07 17.51,27.07 arc(17.32,27.11) 17.16,27.22 16.79,27.58 arc(16.69,27.74) 16.65,27.94 16.65,28.45 arc(16.69,28.64) 16.79,28.8 17.62,29.63 arc(17.73,29.79) 17.77,29.98 U33.23
PB7: length 14.5
  Top Layer w0.13: U32.6 17.77,4.86 arc(17.73,5.05) 17.62,5.21 16.9,5.93 arc(16.79,6.09) 16.75,6.28 16.75,8.65 arc(16.79,8.84) 16.9,9 18.57,10.67 arc(18.67,10.83) 18.71,11.02 18.71,14.09 arc(18.75,14.28) 18.86,14.44 20.02,15.6 arc(20.18,15.71) 20.37,15.75 U1.43
PB8: length 16.9
  Top Layer w0.13: U1.45 20.03,14.75 arc(19.84,14.71) 19.68,14.6 19.32,14.25 arc(19.21,14.09) 19.17,13.9 19.17,10.83 arc(19.14,10.64) 19.03,10.47 17.36,8.81 arc(17.25,8.65) 17.22,8.45 17.22,6.47 arc(17.25,6.28) 17.36,6.12 19.04,4.44 arc(19.15,4.28) 19.19,4.09 19.19,3.55 arc(19.23,3.36) 19.34,3.2 20.16,2.37 arc(20.27,2.21) 20.31,2.02 U32.7
PB9: length 14
  Top Layer w0.13: U1.46 19.77,14.25 arc(19.66,14.23) 19.56,14.16 19.49,14.09 arc(19.43,14) 19.41,13.88 19.41,10.73 arc(19.37,10.54) 19.26,10.38 17.59,8.71 arc(17.48,8.55) 17.45,8.36 17.45,6.57 arc(17.48,6.38) 17.59,6.22 19.91,3.9 arc(20.01,3.83) 20.13,3.81 U32.8
PB10: length 20.5
  Top Layer w0.13: U1.21 28.84,17.25 v1(28.94,17.14) ; v1(30.47,23.49) 30.47,24.74 arc(30.51,24.93) 30.62,25.09 31.76,26.23 arc(31.92,26.34) 32.11,26.38 36.07,26.38 arc(36.26,26.42) 36.42,26.53 U33.8
  Bottom Layer w0.13: v1(28.94,17.14) 29.43,17.63 arc(29.54,17.79) 29.58,17.98 29.58,18.84 arc(29.62,19.03) 29.73,19.19 30.07,19.54 arc(30.23,19.64) 30.42,19.68 30.77,19.68 arc(30.96,19.72) 31.12,19.83 31.97,20.68 arc(32.08,20.84) 32.12,21.03 32.12,22.4 arc(32.08,22.59) 31.97,22.75 31.89,22.84 arc(31.72,22.95) 31.53,22.98 31.18,22.98 arc(30.99,23.02) 30.83,23.13 v1(30.47,23.49)
PB12: length 14.8
  Top Layer w0.13: U33.10 34.71,28.19 arc(34.59,28.17) 34.49,28.1 34.44,28.05 arc(34.38,27.96) 34.36,27.84 34.36,27.76 arc(34.33,27.64) 34.27,27.55 33.71,26.99 arc(33.55,26.88) 33.36,26.84 31.89,26.84 arc(31.7,26.8) 31.53,26.7 31.36,26.53 arc(31.2,26.42) 31.01,26.38 29.54,26.38 arc(29.34,26.34) 29.18,26.23 27.4,24.45 arc(27.29,24.29) 27.25,24.09 U1.25
PB13: length 17
  Top Layer w0.13: U33.9 35.55,29.98 arc(35.51,29.79) 35.4,29.63 34.27,28.5 arc(34.16,28.33) 34.12,28.14 34.12,27.94 arc(34.09,27.74) 33.98,27.58 33.62,27.22 arc(33.45,27.11) 33.26,27.07 31.79,27.07 arc(31.6,27.04) 31.44,26.93 31.27,26.76 arc(31.1,26.65) 30.91,26.61 29.44,26.61 arc(29.25,26.57) 29.09,26.47 26.9,24.28 arc(26.79,24.11) 26.75,23.92 U1.26
PB14: length 12.9
  Top Layer w0.13: U33.12 32.58,28.19 arc(32.39,28.15) 32.23,28.05 31.17,26.99 arc(31.01,26.88) 30.82,26.84 29.34,26.84 arc(29.15,26.8) 28.99,26.7 26.4,24.1 arc(26.29,23.94) 26.25,23.75 U1.27
PB15: length 15.3
  Top Layer w0.13: U1.28 25.75,23.57 arc(25.79,23.77) 25.9,23.93 28.9,26.93 arc(29.06,27.04) 29.25,27.07 30.72,27.07 arc(30.91,27.11) 31.08,27.22 31.47,27.61 arc(31.57,27.77) 31.61,27.97 31.61,28.17 arc(31.65,28.36) 31.76,28.52 32.86,29.63 arc(32.97,29.79) 33.01,29.98 U33.11
PC13: length 21.7
  Top Layer w0.13: v1(17.9,12.83) 17.9,14.93 arc(18.08,15.38) R84.2 ; U1.2 22.25,12.24 22.45,12.04 arc(22.56,11.87) 22.59,11.68 v1(22.59,11.2) 22.59,10.78 arc(22.56,10.59) 22.45,10.43 21.39,9.37 arc(21.28,9.21) 21.24,9.02 21.24,8.45 arc(21.21,8.26) 21.1,8.1 20.69,7.7 arc(20.59,7.53) 20.55,7.34 20.55,7.11 arc(20.57,7) 20.64,6.9 20.75,6.78 arc(20.82,6.69) 20.84,6.57 20.84,5.06 arc(20.88,4.87) 20.99,4.71 21.28,4.42 arc(21.39,4.26) 21.42,4.06 21.42,3.86 arc(21.46,3.67) 21.57,3.5 22.7,2.37 arc(22.81,2.21) 22.85,2.02 U32.9
  Inner1 w0.13: v1(22.59,11.2) arc(22.34,11.81) 21.73,12.06 18.66,12.06 arc(18.12,12.29) v1(17.9,12.83)
RXD_1: length 25.4
  Top Layer w0.13: U1.31 24.25,23.06 arc(24.29,23.25) 24.4,23.41 27.78,26.79 arc(27.89,26.95) 27.93,27.15 U33.16
  Bottom Layer w0.13: U33.16 28.47,28.19 arc(28.85,28.12) 29.18,27.9 29.71,27.37 arc(30.03,27.15) 30.42,27.07 30.84,27.07 arc(31.23,27) 31.55,26.78 33.25,25.09 arc(33.46,24.76) 33.54,24.38 33.54,19.21 arc(33.62,18.82) 33.83,18.5 34.22,18.11 arc(34.43,17.79) 34.51,17.41 U20.4
SWCLK: length 14
  Top Layer w0.13: U1.37 20.99,18.75 20.71,19.03 arc(20.6,19.19) 20.56,19.38 20.56,20.68 arc(20.6,20.87) 20.71,21.03 20.71,21.03 arc(20.82,21.2) 20.86,21.39 20.86,24.42 arc(20.9,24.61) 21,24.77 23.89,27.66 arc(24,27.82) 24.04,28.01 24.04,28.37 arc(24,28.56) 23.89,28.73 22.99,29.63 arc(22.88,29.79) 22.85,29.98 U33.19
SWDIO: length 12.3
  Top Layer w0.13: U1.34 22.75,19.99 arc(22.77,20.11) 22.84,20.21 22.89,20.26 arc(22.95,20.35) 22.98,20.47 22.98,26.21 arc(23.01,26.4) 23.12,26.56 24.12,27.56 arc(24.23,27.72) 24.27,27.91 24.27,28.45 arc(24.31,28.64) 24.41,28.8 25.24,29.63 arc(25.35,29.79) 25.39,29.98 U33.17
TTL_D1+: length 9.4
  Top Layer w0.13: v1(41.52,15.87) 41.52,15.74 arc(41.5,15.63) 41.43,15.53 41.34,15.44 arc(41.24,15.37) 41.13,15.35 40.76,15.35 arc(40.65,15.37) 40.55,15.44 40.33,15.66 arc(40.23,15.73) 40.12,15.75 USB1.6
  Bottom Layer w0.13: v1(41.52,15.87) 41.52,16.13 arc(41.5,16.24) 41.43,16.34 40.14,17.63 arc(39.98,17.74) 39.79,17.78 38.55,17.78 arc(38.36,17.82) 38.2,17.92 37.85,18.27 arc(37.69,18.37) 37.5,18.41 37.07,18.41 arc(36.88,18.37) 36.72,18.27 36.3,17.85 arc(36.23,17.75) 36.21,17.63 U20.7
TTL_D1-: length 6.9
  Top Layer w0.13: v1(40.76,16) 40.51,16 arc(40.39,16.02) 40.3,16.09 40.22,16.16 arc(40.12,16.23) 40.01,16.25 USB1.7
  Bottom Layer w0.13: U20.8 36.71,17.67 arc(36.73,17.79) 36.8,17.88 36.95,18.03 arc(37.11,18.14) 37.3,18.18 37.41,18.18 arc(37.6,18.14) 37.76,18.03 38.1,17.69 arc(38.26,17.58) 38.45,17.55 39.69,17.55 arc(39.88,17.51) 40.05,17.4 40.61,16.84 arc(40.72,16.67) 40.76,16.48 v1(40.76,16)
TXD_1: length 28.6
  Top Layer w0.13: U1.30 24.75,23.23 arc(24.79,23.42) 24.9,23.58 28.9,27.58 arc(29.01,27.74) 29.04,27.94 29.04,28.14 arc(29.08,28.33) 29.19,28.5 30.32,29.63 arc(30.43,29.79) 30.47,29.98 U33.13
  Bottom Layer w0.13: U33.13 30.47,30.19 arc(30.54,29.8) 30.76,29.48 31.29,28.95 arc(31.51,28.62) 31.58,28.24 31.58,27.49 arc(31.66,27.11) 31.88,26.78 33.48,25.18 arc(33.69,24.86) 33.77,24.48 33.77,19.3 arc(33.85,18.92) 34.06,18.6 U20.5
VCAP1: length 20.1
  Top Layer w0.13: U1.22 28.71,17.75 arc(28.78,17.77) 28.85,17.81 v1(28.94,17.91) ; 31.89,26.61 35.34,26.61 arc(35.53,26.65) 35.69,26.76 36.52,27.58 arc(36.63,27.74) 36.66,27.94 36.66,28.14 arc(36.7,28.33) 36.81,28.5 37.94,29.63 arc(38.05,29.79) 38.09,29.98 U33.7 ; v1(29.18,19.72) C81.1 29.83,24.43 arc(29.87,24.62) 29.98,24.78 31.79,26.59 arc(31.84,26.61) 31.89,26.61
  Bottom Layer w0.13: v1(29.18,19.72) 29.18,18.17 arc(29.17,18.14) 29.15,18.11 v1(28.94,17.91)
$1N3260: length 1.8
  Top Layer w0.13: R70.1 17.61,22.65 arc(17.67,22.58) 17.68,22.49 LED3.2
$1N6017: length 23.5
  Top Layer w0.13: C65.2 38.96,10.45 arc(39.82,10.81) USB1.13 USB1.13 45.57,11.67 arc(46.3,11.97) 46.6,12.7 46.6,19.17 arc(46.26,19.99) 45.45,20.33 USB1.14 USB1.14
$1N6108: length 4.3
  Top Layer w0.13: USB1.4 38.87,14.75 arc(38.23,14.48) 37.96,13.84 37.96,13.76 arc(37.74,13.22) v1(37.2,13)
  Bottom Layer w0.13: R77.1 v1(37.2,13)
$1N6111: length 3.9
  Top Layer w0.13: v1(37.07,19) 37.5,19 arc(37.92,18.83) 38.09,18.41 arc(38.28,17.94) 38.75,17.75 USB1.10
  Bottom Layer w0.13: v1(37.07,19) R78.1
$1N27095: length 8.8
  Bottom Layer w0.5: C78.1 27.04,21.46 arc(26.63,22.45) 25.64,22.86 21.71,22.86 arc(20.79,22.48) 20.41,21.56 D1.1
$1N27260: length 5.3
  Bottom Layer w0.3: R82.1 R83.2 arc(22.9,13.66) 23.95,14.09 U8.4
$1N29436: length 2.6
  Bottom Layer w0.5: C78.2 27.04,19.17 arc(26.67,18.27) U8.1
$1N49858: length 1.7
  Top Layer w0.13: R84.1 18.26,16.7 arc(18.1,16.81) 17.91,16.85 LED4.2
$1N55601: length 2.3
  Top Layer w0.13: SW3.1 35.6,10.06 arc(36,11.03) R79.2

## Copper pours and planes (outline as drawn; the poured copper is in the pictures)
3V3 on Inner1: -1.73,33.02 48.44,33.02 48.44,-1.02 -1.73,-1.02
12V on Inner1: 11.46,5.03 11.46,-1.04 -1.64,-1.04 -1.64,33.04 11.46,33.04 11.46,26.95 15.56,22.94 15.56,9.04
12V on Inner2: 11.43,5.03 11.43,-1.04 -1.67,-1.04 -1.67,33.04 11.44,33.04 11.43,26.95 15.53,22.94 15.53,9.04
AGND on Top Layer: 11.43,5.03 11.43,-1.04 -1.67,-1.04 -1.67,33.04 11.44,33.04 11.43,26.95 15.54,22.94 15.54,9.04
AGND on Bottom Layer: 11.42,5.03 11.42,-1.04 -1.68,-1.04 -1.68,33.04 11.43,33.04 11.42,26.95 15.52,22.94 15.52,9.04
GND on Top Layer: -1.92,33.02 48,33.02 48,-1.02 -1.92,-1.02
GND on Bottom Layer: -1.69,33.15 48.22,33.15 48.22,-0.89 -1.69,-0.89
GND on Inner2: -1.5,32.99 48.41,32.99 48.41,-1.05 -1.5,-1.05
$1N27095 on Bottom Layer: 19.42,22.19 21.5,22.19 21.5,17.52 19.42,17.52
$1N27095 on Bottom Layer: 26.42,22.6 31.75,22.6 31.75,20.5 26.42,20.5

Small or netless copper shapes (teardrops, artwork), in the pictures only: 217 on Top Layer, 106 on Bottom Layer, 32 on Inner1
